# Altium schematic sheet Z plaat.SchDoc
size A4
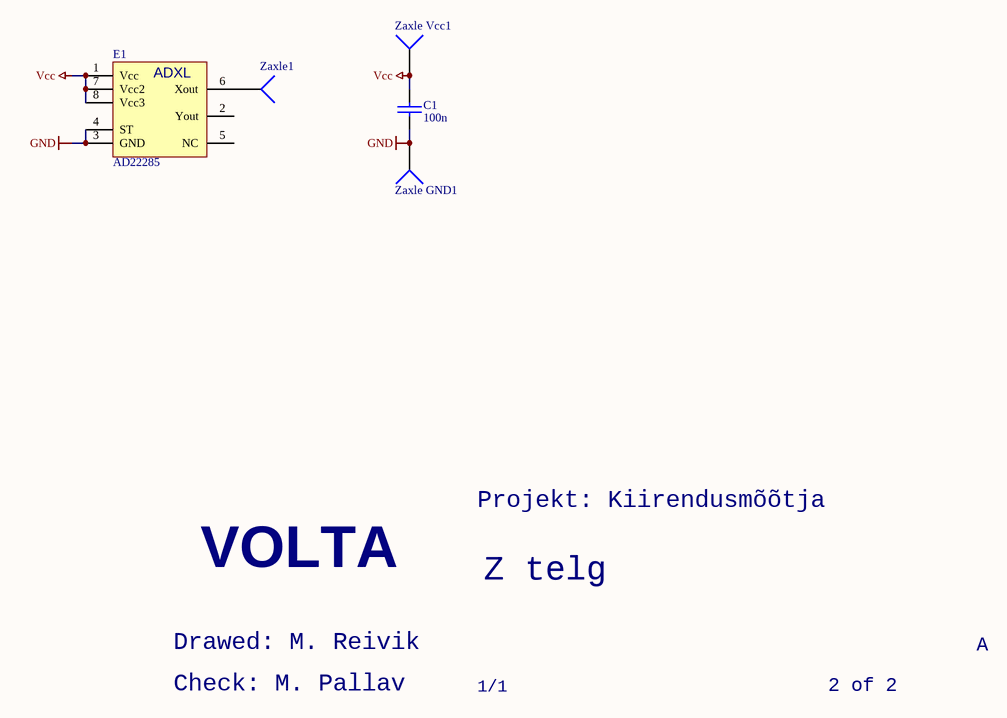
[diagram p0: Z plaat.SchDoc]

## Parts
C1  100n  [CR1608-0603]
E1  AD22285  [ADXL]
Zaxle1  Socket  [MW]  (value not drawn)
Zaxle_GND1  Socket  [MW]  (value not drawn)
Zaxle_Vcc1  Socket  [MW]  (value not drawn)

## Nets
GND: C1.1 E1.3(GND) E1.4(ST) Zaxle_GND1.1
Vcc: C1.2 E1.1(Vcc) E1.7(Vcc2) E1.8(Vcc3) Zaxle_Vcc1.1
NetE1_6: E1.6(Xout) Zaxle1.1

Not connected (* = marked no-connect by the designer): E1 2(Yout) 5(NC)

## Notes on the sheet
- Projekt: Kiirendusmõõtja
- VOLTA
- Z telg
- Drawed: M. Reivik
- A
- Check: M. Pallav
- 1/1
- 2 of 2
- (in symbol AD22285) ADXL

## Library data of the parts
C1 = CAP: Capacitor
E1 = AD22285: Accelerometer
Zaxle1 Zaxle_GND1 Zaxle_Vcc1 = Socket: LatestRevisionDate: 17-Jul-2002; LatestRevisionNote: Re-released for DXP Platform.; Publisher: Altium Limited